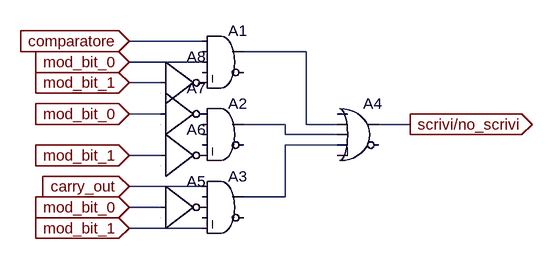
[diagram p0: schematic decisore.asc]
decisore.asc, the LTspice schematic file:
Version 4
SHEET 1 880 680
WIRE 80 96 -32 96
WIRE 240 112 144 112
WIRE 80 128 -32 128
WIRE 16 160 -32 160
WIRE 16 208 -32 208
WIRE 208 224 144 224
WIRE 240 224 240 112
WIRE 288 224 240 224
WIRE 400 224 352 224
WIRE 208 240 208 224
WIRE 288 240 208 240
WIRE 288 256 208 256
WIRE 16 272 -32 272
WIRE 80 320 -32 320
WIRE 208 336 208 256
WIRE 208 336 144 336
WIRE 16 352 -32 352
WIRE 80 384 -32 384
FLAG -32 96 comparatore
IOPIN -32 96 In
FLAG -32 128 mod_bit_0
IOPIN -32 128 In
FLAG -32 160 mod_bit_1
IOPIN -32 160 In
FLAG -32 208 mod_bit_0
IOPIN -32 208 In
FLAG -32 272 mod_bit_1
IOPIN -32 272 In
FLAG -32 320 carry_out
IOPIN -32 320 In
FLAG -32 352 mod_bit_0
IOPIN -32 352 In
FLAG -32 384 mod_bit_1
IOPIN -32 384 In
FLAG 400 224 scrivi/no_scrivi
IOPIN 400 224 Out
SYMBOL Digital\\and 112 64 R0
SYMATTR InstName A1
SYMBOL Digital\\and 112 176 R0
SYMATTR InstName A2
SYMBOL Digital\\and 112 288 R0
SYMATTR InstName A3
SYMBOL Digital\\or 320 176 R0
SYMATTR InstName A4
SYMBOL Digital\\inv 16 208 R0
SYMATTR InstName A6
SYMBOL Digital\\inv 16 144 R0
SYMATTR InstName A7
SYMBOL Digital\\inv 16 288 R0
SYMATTR InstName A5
SYMBOL Digital\\inv 16 96 R0
SYMATTR InstName A8

The netlist it stands for:
* decisore.asc
A1 comparatore 0 mod_bit_0 0 P001 0 N001 0 AND
A2 P002 0 0 0 P003 0 N002 0 AND
A3 carry_out 0 P004 0 mod_bit_1 0 N003 0 AND
A4 0 N001 N002 N003 0 0 scrivi/no_scrivi 0 OR
A6 mod_bit_1 0 0 0 0 P003 0 0 BUF
A7 mod_bit_0 0 0 0 0 P002 0 0 BUF
A5 mod_bit_0 0 0 0 0 P004 0 0 BUF
A8 mod_bit_1 0 0 0 0 P001 0 0 BUF
.backanno
.end